# EAGLE design ArduiLED (EAGLE 6.4)
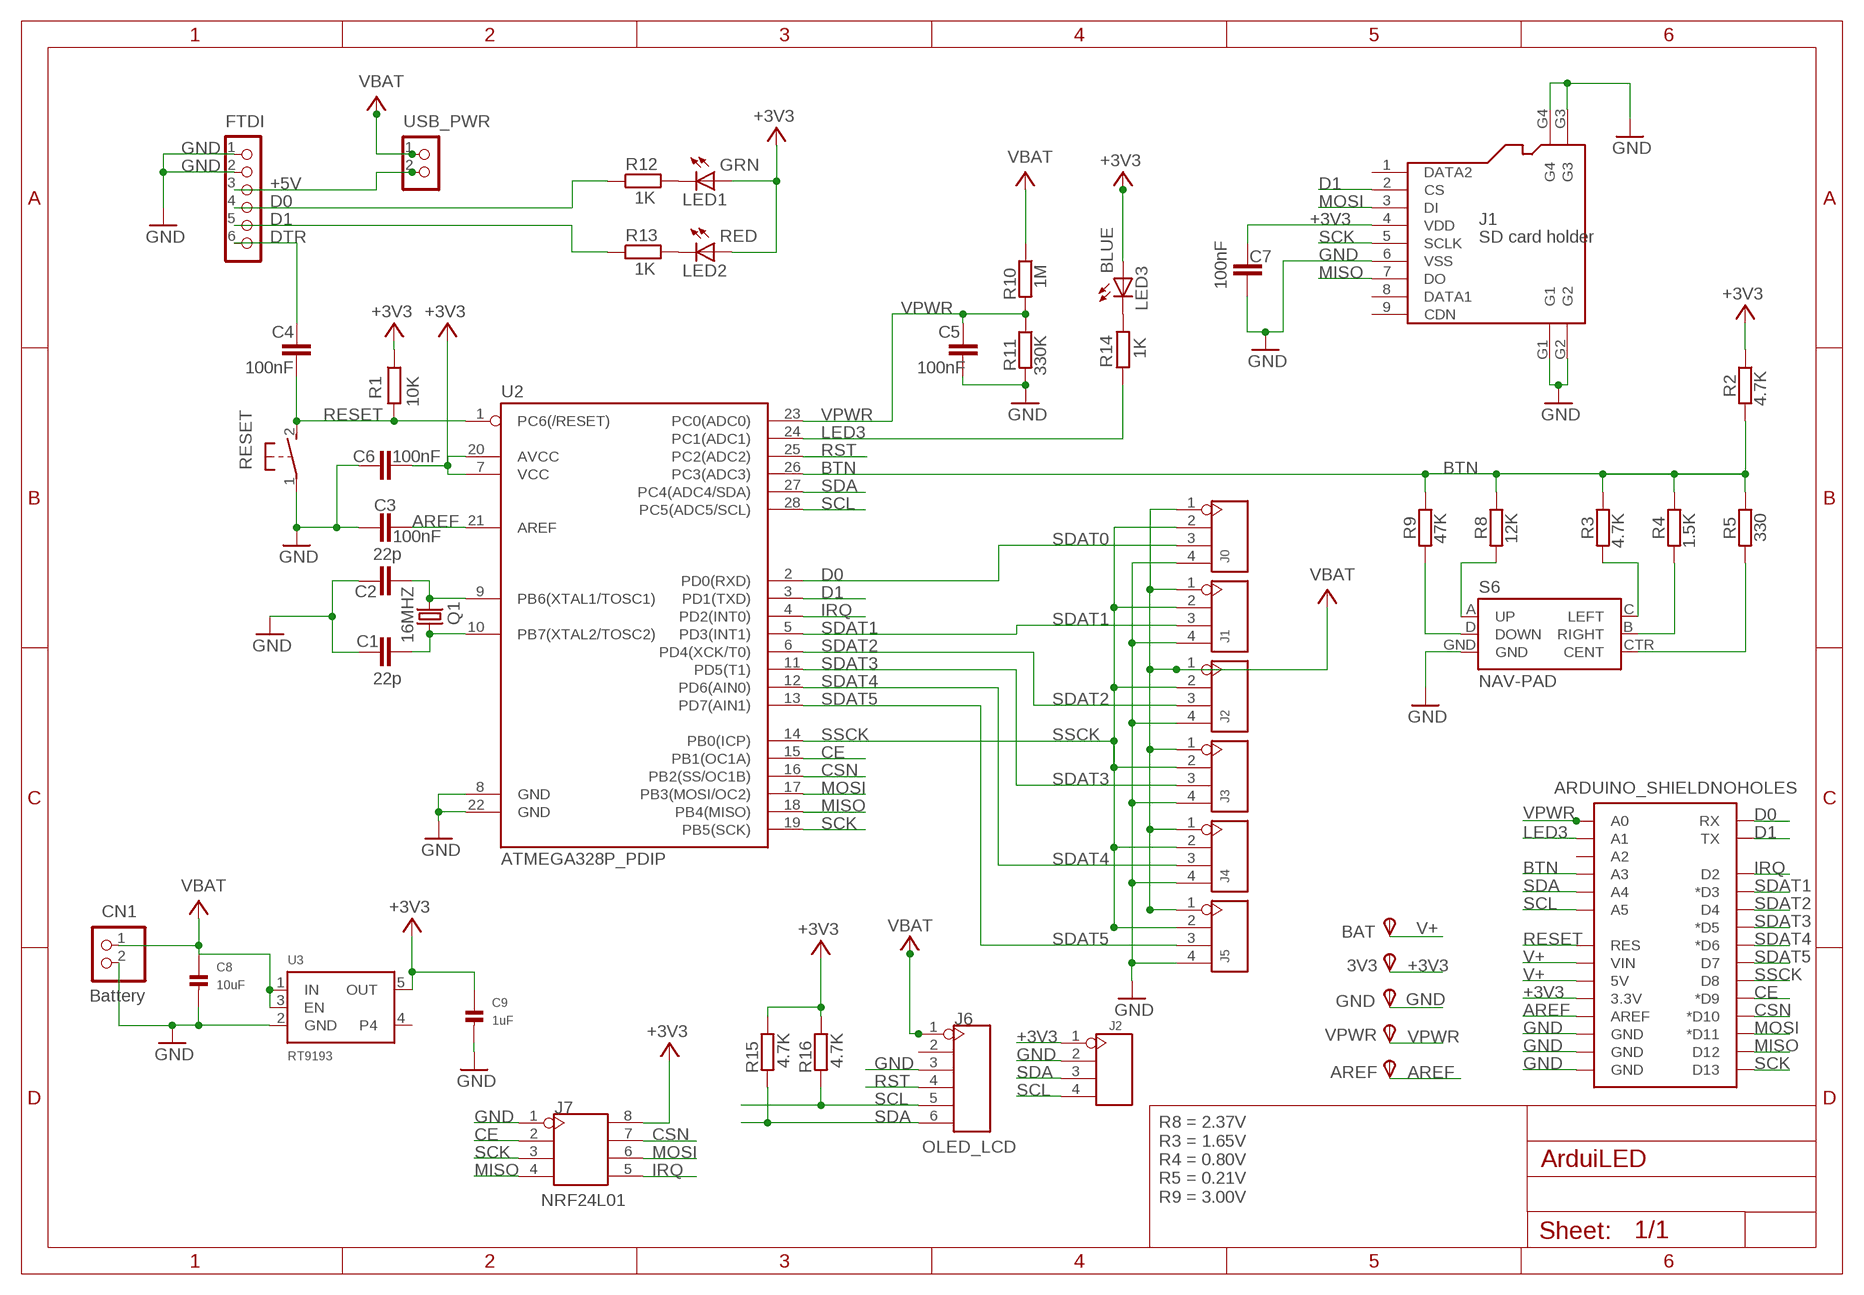
[diagram p0: schematic, sheet 1]

## Parts
3V3  TPSPAD1-13  [P1-13]
AREF  TPSPAD1-13  [P1-13]
BAT  TPSPAD1-13  [P1-13]
BRA  J2  HEADER-4P-80/40MIL  [4P-2.54-80/40MIL]
BRAS  J3  HEADER-4P-80/40MIL  [4P-2.54-80/40MIL]
C1  22p  C-EUC0805K  [C0805K]
C2  22p  C-EUC0805K  [C0805K]
C3  100nF  C-EUC0805K  [C0805K]
C4  100nF  C-EUC0805  [C0805]
C5  100nF  C-EUC0805K  [C0805K]
C6  100nF  C-EUC0805K  [C0805K]
C7  100nF  C-EUC0805K  [C0805K]
C8  10uF  CAP_CERAMIC0805  [0805]
C9  1uF  CAP_CERAMIC0805  [0805]
CN1  Battery  JST_2PIN-SMT-RA  [JST-PH-2-SMT-RA]
D7  J5  HEADER-4P-80/40MIL  [4P-2.54-80/40MIL]
FTDI  CON_HEADER_1X06-PTH-RIGHT-ANGLED  [M1X6_MALE_RIGHT_ANGLED]
GND  TPSPAD1-13  [P1-13]
J1  SD card holder  HOLDER-MICROSD-9P  [9P-SMD-W/-RING]
J2  HEADER-4P-65/35MIL  [4P-65/35MIL]
J6  OLED_LCD  HEADER-6P-65/35MIL  [6P-2.54-65/35MIL]
J7  NRF24L01  HEADER-2X4P-2.54  [2X4P-2.54]
JAMB  J4  HEADER-4P-80/40MIL  [4P-2.54-80/40MIL]
LED1  GRN  LED-0805  [LED-805]
LED2  RED  LED-0805  [LED-805]
LED3  BLUE  LED-0805  [LED-805]
Q1  16MHZ  CRYSTALHC49U-V  [HC49U-V]
R1  10K  R-EU_M0805  [M0805]
R2  4.7K  R-EU_M0805  [M0805]
R3  4.7K  R-EU_M0805  [M0805]
R4  1.5K  R-EU_M0805  [M0805]
R5  330  R-EU_M0805  [M0805]
R8  12K  R-EU_M0805  [M0805]
R9  47K  R-EU_M0805  [M0805]
R10  1M  R-EU_M0805  [M0805]
R11  330K  R-EU_M0805  [M0805]
R12  1K  R-EU_M0805  [M0805]
R13  1K  R-EU_M0805  [M0805]
R14  1K  R-EU_M0805  [M0805]
R15  4.7K  R-EU_M0805  [M0805]
R16  4.7K  R-EU_M0805  [M0805]
RESET  DTSM-3  [DTSM-3]
S6  NAV-PAD  JOYSTICK_MINI  [JOYSTICK_MINI]
TETE  J0  HEADER-4P-80/40MIL  [4P-2.54-80/40MIL]
TRONC  J1  HEADER-4P-80/40MIL  [4P-2.54-80/40MIL]
U1  ARDUINO_SHIELDNOHOLES  [DUEMILANOVE_SHIELD_NOHOLES]
U2  ATMEGA328P_PDIP  [DIL28-3]
U3  RT9193  VREG_SOT23-5  [SOT23-5]
USB_PWR  CON_HEADER_1X02-PTH  [M1X2]
VPWR  TPSPAD1-13  [P1-13]

## Nets
+3V3 [Power]: 3V3.TP(PP) C6.2 C7.1 C9.1 J1.4(VDD) J2.1 J7.8 LED1.A LED2.A LED3.A R1.1 R2.1 R15.1 R16.1 U1.3.3V U2.7(VCC) U2.20(AVCC) U3.5(OUT)
+5V [Power]: FTDI.3 USB_PWR.2
AREF: AREF.TP(PP) C3.1 U1.AREF U2.21(AREF)
BTN: R2.2 R3.1 R4.1 R5.1 R8.1 R9.1 U1.A3 U2.26(PC3(ADC3))
CE: J7.2 U1.D9(*D9) U2.15(PB1(OC1A))
CSN: J7.7 U1.D10(*D10) U2.16(PB2(SS/OC1B))
D0: FTDI.4 R12.1 TETE.3 U1.RX U2.2(PD0(RXD))
D1: FTDI.5 J1.2(CS) R13.1 U1.TX U2.3(PD1(TXD))
DTR: C4.1 FTDI.6
GND [Power]: BRA.4 BRAS.4 C1.1 C2.1 C3.2 C5.2 C6.1 C7.2 C8.2 C9.2 CN1.2 D7.4 FTDI.1 FTDI.2 GND.TP(PP) J1.6(VSS) J1.G1 J1.G2 J1.G3 J1.G4 J2.2 J6.3 J7.1 JAMB.4 R11.2 RESET.1 S6.GND TETE.4 TRONC.4 U1.GND@0(GND) U1.GND@1(GND) U1.GND@2(GND) U2.8(GND) U2.22(GND) U3.2(GND)
IRQ: J7.5 U1.D2 U2.4(PD2(INT0))
LED3: R14.1 U1.A1 U2.24(PC1(ADC1))
MISO: J1.7(DO) J7.4 U1.D12 U2.18(PB4(MISO))
MOSI: J1.3(DI) J7.6 U1.D11(*D11) U2.17(PB3(MOSI/OC2))
N$1: C2.2 Q1.2 U2.9(PB6(XTAL1/TOSC1))
N$2: C1.2 Q1.1 U2.10(PB7(XTAL2/TOSC2))
N$3: R8.2 S6.A(UP)
N$4: LED1.C R12.2
N$6: R3.2 S6.C(LEFT)
N$7: LED2.C R13.2
N$8: LED3.C R14.2
N$9: R4.2 S6.B(RIGHT)
N$10: R5.2 S6.CTR(CENT)
N$12: R9.2 S6.D(DOWN)
RESET: C4.2 R1.2 RESET.2 U1.RES U2.1(PC6(/RESET))
RST: J6.4 U2.25(PC2(ADC2))
SCK: J1.5(SCLK) J7.3 U1.D13 U2.19(PB5(SCK))
SCL: J2.4 J6.5 R16.2 U1.A5 U2.28(PC5(ADC5/SCL))
SDA: J2.3 J6.6 R15.2 U1.A4 U2.27(PC4(ADC4/SDA))
SDAT1: TRONC.3 U1.D3(*D3) U2.5(PD3(INT1))
SDAT2: BRA.3 U1.D4 U2.6(PD4(XCK/T0))
SDAT3: BRAS.3 U1.D5(*D5) U2.11(PD5(T1))
SDAT4: JAMB.3 U1.D6(*D6) U2.12(PD6(AIN0))
SDAT5: D7.3 U1.D7 U2.13(PD7(AIN1))
SSCK: BRA.2 BRAS.2 D7.2 JAMB.2 TETE.2 TRONC.2 U1.D8 U2.14(PB0(ICP))
V+ [Power]: BAT.TP(PP) BRA.1 BRAS.1 C8.1 CN1.1 D7.1 J6.1 JAMB.1 R10.1 TETE.1 TRONC.1 U1.5V U1.VIN U3.1(IN) U3.3(EN) USB_PWR.1 ; supply symbol labelled VBAT
VPWR: C5.1 R10.2 R11.1 U1.A0 U2.23(PC0(ADC0)) VPWR.TP(PP)
Unconnected: J1.1(DATA2) J1.8(DATA1) J1.9(CDN) J6.2 U1.A2 U3.4

## Notes on the sheet
- SDAT0
- R8 = 2.37V
  R3 = 1.65V
  R4 = 0.80V
  R5 = 0.21V
  R9 = 3.00V

## Library data of the parts
3V3 AREF BAT GND VPWR = testpad:TPS: TEST PIN
BRA BRAS D7 J2 JAMB TETE TRONC = Seeed-Connector:HEADER-4P
C1-C7 = resistor:C-EU: CAPACITOR, European symbol
C8 C9 = microbuilder:CAP_CERAMIC: Ceramic Capacitors 0402 - 0402 Surface Mount Capacitors 16pF 50V 5% [Digikey: 445-4899-2-ND] 18pF 50V 5% [Digikey: 490-1281-2-ND] 22pF 50V 5% [Digikey: 490-1283-2-ND] 68pF 50V 5% [Digikey: 490-1289-2-ND] 0.1uF 10V 10% [Digikey: 490-1318-2-ND] 1.0uF 6.3V 10% [Digikey: 490-1320-2-ND] 0603 - 0603 Surface Mount Capacitors 16 pF 50V 5% [Digikey: 445-5051-2-ND] 22 pF 50V [Digikey: PCC220ACVTR-ND] 33 pF 50V 5% [Digikey: 490-1415-1-ND] 56pF 50V 5% [Digikey: 490-1421-1-ND] 220pF 50V 5% [Digikey: 445-1285-1-ND] 680 pF 50V 2200 pF 50V 5% C0G [Digikey: 445-1297-1-ND] 5600 pF 100V 5% X7R [Digikey: 478-3711-1-ND] 0.1 µF 25V 10% [Digikey: PCC2277TR-ND] 0.22 µF 16V 10% X7R [Digikey: 445-1318-1-ND] 1.0 µF 25V 10% [Digikey: 445-5146-2-ND] 0603 - RF Specific 3pF 250V +/-0.1pF RF [Digikey: 712-1347-1-ND] 18 pF 250V 5% [Digikey: 478-3505-1-ND or 712-1322-1-ND] 56 pF 250V 5% C0G RF [Digikey: 490-4867-1-ND] 68 pF 250V RF [Digikey: 490-4868-1-ND] 0805 - 0805 Surface Mount Capacitors 220 pF 250V 2% RF Ceramic Capacitor [Digikey: 712-1398-1-ND] 1000 pF 50V 2% NP0 Ceramic Capacitor [Digikey: 478-3760-1-ND] 0.1 µF 25V 10% Ceramic Capacitor [Digikey: PCC1828TR-ND] 1.0 µF 16V 10% Ceramic Capacitor[Digikey: 490-1691-2-ND] 10.0 µF 10V 10% Ceramic Capacitor[Digikey: 709-1228-1-ND] 10.0 uF 16V 10% Ceramic Capacitor [Digikey: 478-5165-2-ND] 47 uF 6.3V 20% Ceramic Capacitor [Digikey: 587-1779-1-ND or 399-5506-1-ND] 1206 - 1206 Surface Mount Capacitors 47uF 10V 20% Ceramic Capacitor [Digikey: 490-5528-1-ND or 399-5508-1-ND or 445-6010-1-ND] 100uF 6.3V -20%, +80% Y5V Ceramic Capacitor (Digikey: 490-4512-1-ND, Mouser: 81-GRM31CF50J107ZE1L)
CN1 = adafruit:JST_2PIN: JST 2-Pin Connectors of various flavors SMT-RA (S2B-PH-SM4) 4UConnector #17311 SMT (B2B-PH-SM4) THM-RA (S2B-PH) THM (B2B-PH)
FTDI = dp_devices:CON_HEADER_1X06
J1 = Connector:HOLDER-MICROSD-9P
J6 = Seeed-Connector:HEADER-6P
J7 = Seeed-Connector:HEADER-2X4P
LED1-LED3 = dp_devices:LED: Light Emitting Diode
Q1 = crystal:CRYSTAL: CRYSTAL; OC_FARNELL: 1666969; OC_NEWARK: unknown
R1-R5 R8-R16 = resistor:R-EU_: RESISTOR, European symbol
RESET = switch-tact:DTSM-3
S6 = SparkFun-Electromechanical:JOYSTICK_MINI: Small 5-way tactile joystick, COM-10063 4UCON SF303GJ26
U1 = SparkFun-Boards:ARDUINO_SHIELD: Arduino shield footprint
U2 = SparkFun-DigitalIC:ATMEGA328P_PDIP: uC used in the Arduino 32kb flash, 1k EEPROM, 2k SRAM This is the through-hole version of this chip.
U3 = microbuilder:VREG_SOT23-5: SOT23-5 Fixed Voltage Regulators To better organise some of the SOT23-5 fixed voltage regulators in this library, this new part was created. Part Current Out V Out V In V Dropout Digikey Part No. ADP121 150mA 3.3V 3.4-5.5V 0.09V @ 150mA ADP121-AUJZ33R7CT-ND ADP121 150mA 3.0V 3.1-5.5V 0.09V @ 150mA ADP121-AUJZ30R7CT-ND ADP122 300mA 3.3V 3.4-5.5V 0.085V @ 300mA ADP122AUJZ-3.3-R7CT-ND ADP1712 300mA 3.3V 3.5-5.5V 0.17V @ 300mA ADP1712AUJZ-3.3-R7TR-ND AP7311 (Low Cost) 150mA 3.3V 3.5-6V 0.15V @ 150mA AP7311-33WG-7DICT-ND LD39015M18R 150mA 1.8V 1.9V-5.5V 0.08V @ 100mA 497-6977-1-ND MCP1824T-3302E/OT 300mA 3.3V 3.5V-6V 0.2V @ 300mA MCP1824T-3302E/OTCT-ND MIC5205-2.5YM5 TR 150mA 2.5V 2.7-16V 0.165V @ 150mA 576-1257-2-ND MIC5205-3.0YM5 TR 150mA 3.0V 3.2V-16V 0.165V @ 150mA 576-1258-2-ND MIC5205-3.3YM5 TR 150mA 3.3V 3.5V-16V 0.165V @ 150mA 576-1259-2-ND TPS780330220 150mA 3.3V+2.2V 3.6-5.5V 250mV Max 296-23332-1-ND TDA3663/N1,135 100mA 3.3V 3.5-45V 0.18V @ 50mA 568-5343-1-ND
USB_PWR = dp_devices:CON_HEADER_1X02

## Net classes
1 Power: width 0.203 mm, drill 0.305 mm, clearance 0.152 mm
2 Big Power: width 0.203 mm, drill 0.305 mm, clearance 0.152 mm

## Board
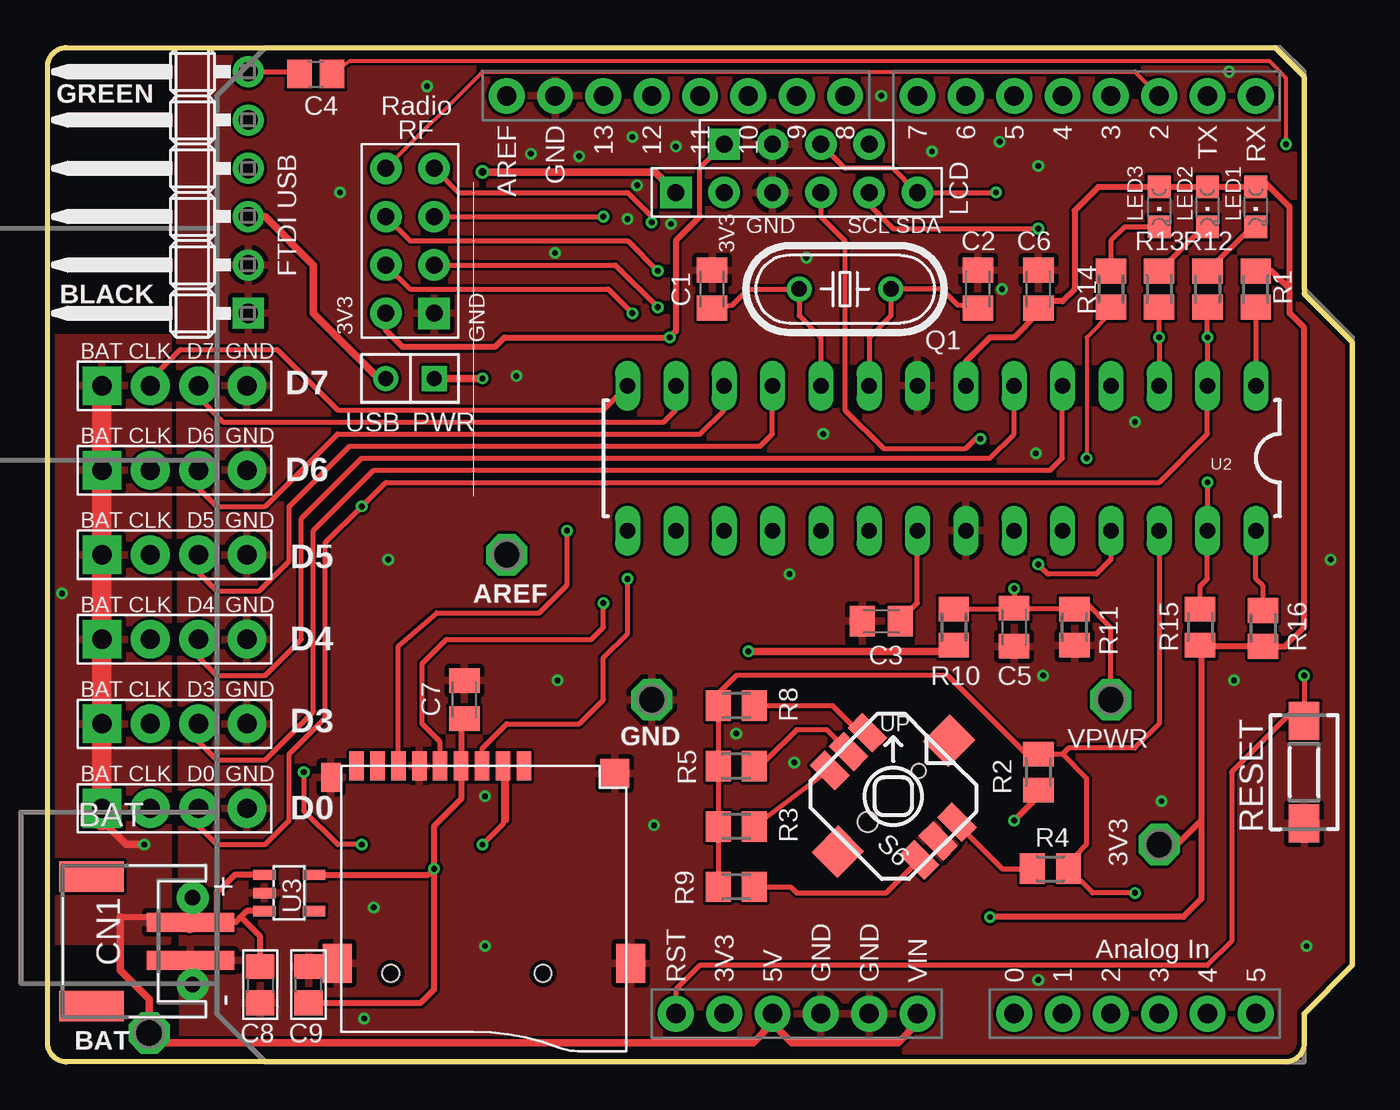
[diagram p1: board, top side]
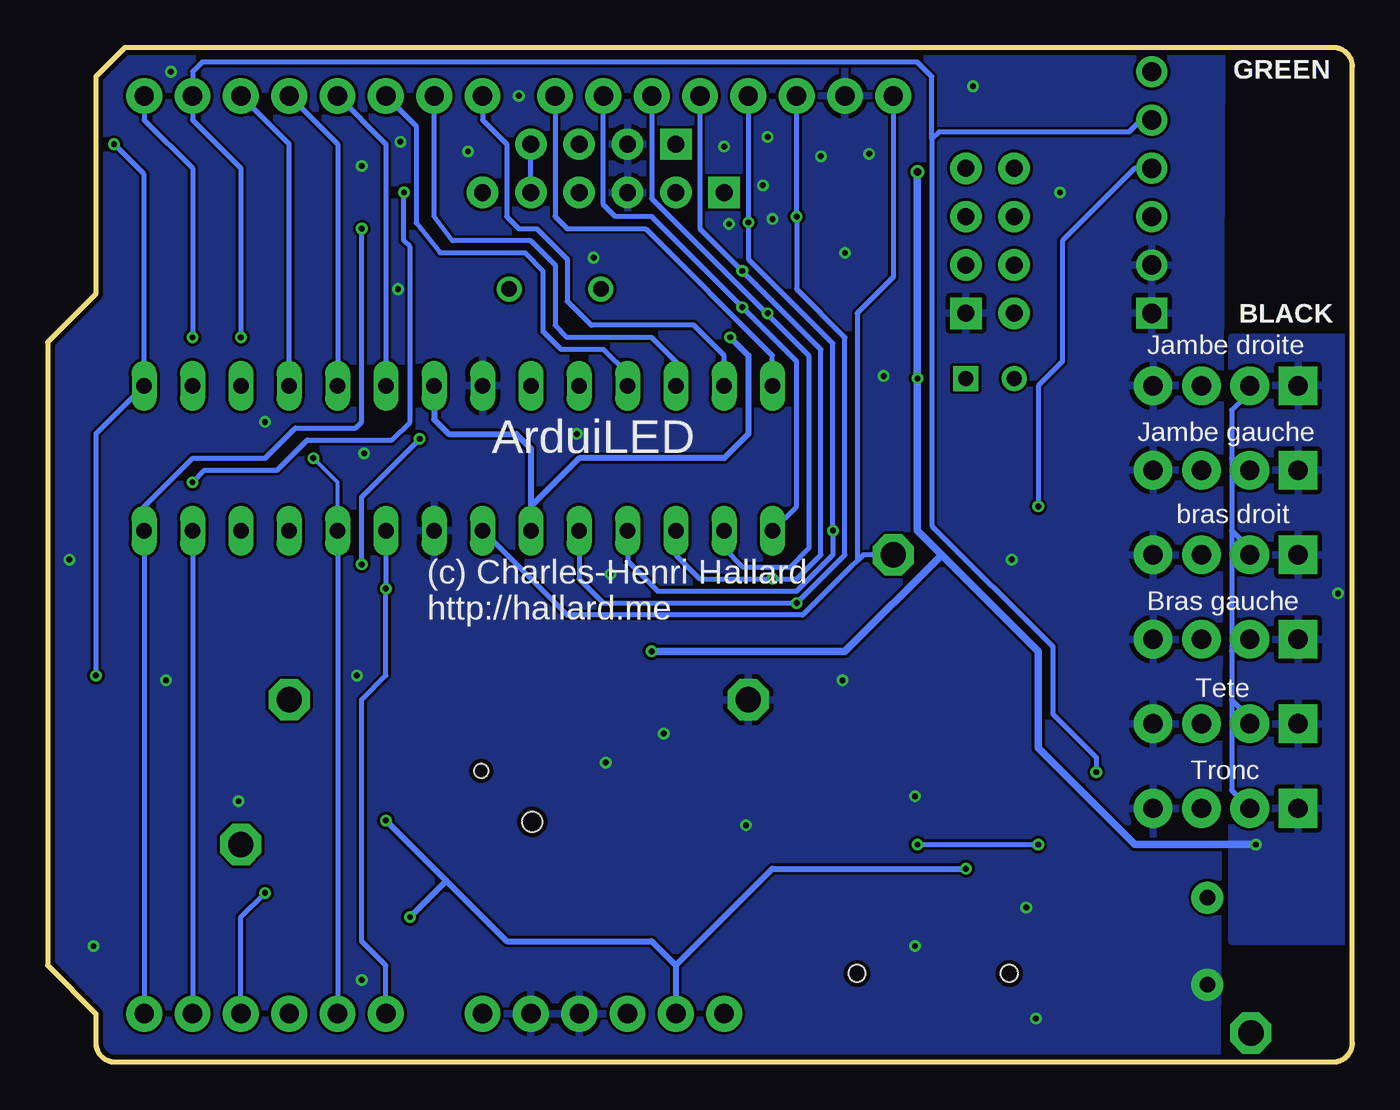
[diagram p2: board, bottom side, seen from below]

Size 68.58 x 53.34 mm. Coordinates in mm from the lower left corner, seen from the top.
Outline: 64.52,53.34 66.04,51.82 66.04,40.39 68.58,37.85 68.58,5.08 66.04,2.54 66.04,1 arc-90 65.04,0 1,0 arc-90 0,1 0,52.34 arc-90 1,53.34 64.52,53.34
Copper layers (1*16): Top 0.035mm / dielectric 1.5mm / Bottom 0.035mm
Design rules "SeedStudio_v1.1": minimum track width 6mil, minimum drill 12mil, track to track 6mil, track to pad 6mil, pad to pad 6mil, via to via 6mil, smd to smd 0mil, copper to edge 10mil, drill to drill 10mil, minimum pad ring 10mil, minimum via ring 6mil, stop-mask expansion 2mil, vias tented up to drill 100mil, thermal gap 10mil

### Footprints (pad centres in the part's own frame; a part is rotated, then mirrored left to right if it is on the bottom)
P1-13 = drill 1.321 pad 2.159 octagon: TP 0,0
4P-2.54-80/40MIL = drill 1.016 pad 2.032 square: 1 0,3.81 | drill 1.016 pad 2.032: 2 0,1.27; 3 0,-1.27; 4 0,-3.81
C0805K = smd 1.3 x 1.6: 1 -1,0; 2 1,0
C0805 = smd 1.3 x 1.5: 1 -0.85,0; 2 0.85,0
0805 = smd 1.3 x 1.5: 1 -0.95,0; 2 0.95,0
JST-PH-2-SMT-RA = smd 1 x 4.6: 1 1,-3.7; 2 -1,-3.7 | smd 1.6 x 3.4: NC1 -3.4,1.5; NC2 3.4,1.5
M1X6_MALE_RIGHT_ANGLED = drill 1.02 pad 1.632 square: 1 -6.35,-2.925 | drill 1.02 pad 1.632: 2 -3.81,-2.925; 3 -1.27,-2.925; 4 1.27,-2.925; 5 3.81,-2.925; 6 6.35,-2.925
9P-SMD-W/-RING = smd 1.524 x 0.762: 1 0,4.4; 2 0,3.3; 3 0,2.2; 4 0,1.1; 5 0,0; 6 0,-1.1; 7 0,-2.2; 8 0,-3.3; 9 0,-4.4 | smd 1.524 x 1.016: G1 0.6,-5.746 | smd 2.032 x 1.524: G2 10.373,-5.4; G3 10.373,10 | smd 1.524 x 1.524: G4 0.392,9.181 | hole 0.889: 10.9,-2.6; 10.9,5.4
4P-65/35MIL = drill 0.889 pad 1.651 square: 1 0,3.81 | drill 0.889 pad 1.651: 2 0,1.27; 3 0,-1.27; 4 0,-3.81
6P-2.54-65/35MIL = drill 0.889 pad 1.651 square: 1 0,6.35 | drill 0.889 pad 1.651: 2 0,3.81; 3 0,1.27; 4 0,-1.27; 5 0,-3.81; 6 0,-6.35
2X4P-2.54 = drill 0.889 pad 1.651 square: 1 -1.27,3.81 | drill 0.889 pad 1.651: 2 -1.27,1.27; 3 -1.27,-1.27; 4 -1.27,-3.81; 5 1.27,-3.81; 6 1.27,-1.27; 7 1.27,1.27; 8 1.27,3.81
LED-805 = smd 1.2 x 1.2: A 0,-1.05; C 0,1.05
HC49U-V = drill 0.813: 1 -2.413,0; 2 2.413,0
M0805 = smd 1.3 x 1.6: 1 -0.95,0; 2 0.95,0
DTSM-3 = smd 2 x 1.6: 1 -2.7,0; 2 2.7,0
JOYSTICK_MINI = smd 1.85 x 1.1: A -3.325,1.4; B 3.325,1.4; C -3.325,-1.4; CTR -3.325,0; D 3.325,-1.4; GND 3.325,0 | smd 1.9 x 2: NC 0,4.13; NC@0 0,-4.13 | hole 0.75: 0,1.9 | hole 1.05: 0,-1.9
DUEMILANOVE_SHIELD_NOHOLES = drill 1.016 pad 1.88: 3.3V 50.8,26.67; 5V 50.8,29.21; A0 50.8,41.91; A1 50.8,44.45; A2 50.8,46.99; A3 50.8,49.53; A4 50.8,52.07; A5 50.8,54.61; AREF 2.54,15.24; D2 2.54,49.53; D3 2.54,46.99; D4 2.54,44.45; D5 2.54,41.91; D6 2.54,39.37; D7 2.54,36.83; D8 2.54,33.02; D9 2.54,30.48; D10 2.54,27.94; D11 2.54,25.4; D12 2.54,22.86; D13 2.54,20.32; GND@0 50.8,31.75; GND@1 50.8,34.29; GND@2 2.54,17.78; RES 50.8,24.13; RX 2.54,54.61; TX 2.54,52.07; VIN 50.8,36.83
DIL28-3 = drill 0.813 long: 1 -16.51,-3.81; 2 -13.97,-3.81; 3 -11.43,-3.81; 4 -8.89,-3.81; 5 -6.35,-3.81; 6 -3.81,-3.81; 7 -1.27,-3.81; 8 1.27,-3.81; 9 3.81,-3.81; 10 6.35,-3.81; 11 8.89,-3.81; 12 11.43,-3.81; 13 13.97,-3.81; 14 16.51,-3.81; 15 16.51,3.81; 16 13.97,3.81; 17 11.43,3.81; 18 8.89,3.81; 19 6.35,3.81; 20 3.81,3.81; 21 1.27,3.81; 22 -1.27,3.81; 23 -3.81,3.81; 24 -6.35,3.81; 25 -8.89,3.81; 26 -11.43,3.81; 27 -13.97,3.81; 28 -16.51,3.81
SOT23-5 = smd 0.55 x 1.2: 1 -0.95,-1.3; 2 0,-1.3; 3 0.95,-1.3; 4 0.95,1.3; 5 -0.95,1.3
M1X2 = drill 0.8 square: 1 -1.27,0 | drill 0.8: 2 1.27,0

### Placement (x,y rotation side)
3V3  58.42,11.43 0 top
AREF  24.13,26.67 0 top
BAT  5.33,1.52 0 top
BRA  6.67,22.23 90 top
BRAS  6.67,26.67 90 top
C1  34.92,40.64 270 top
C2  48.9,40.64 270 top
C3  43.81,23.18 180 top
C4  14.1,51.94 0 top
C5  50.8,22.86 270 top
C6  52.07,40.64 270 top
C7  21.91,19.05 90 top
C8  11.18,4.06 270 top
C9  13.72,4.06 90 top
CN1  3.81,6.35 90 top
D7  6.67,35.56 90 top
FTDI  7.62,45.72 90 top
GND  31.75,19.05 0 top
J1  20.64,15.56 270 top
J2  39.37,48.26 90 top
J6  39.37,45.72 90 top
J7  19.05,43.18 180 top
JAMB  6.67,31.11 90 top
LED1  63.5,44.96 180 top
LED2  60.96,44.96 180 top
LED3  58.42,44.96 180 top
Q1  41.91,40.64 0 top
R1  63.5,40.64 270 top
R2  52.07,15.24 90 top
R3  36.2,12.38 0 top
R4  52.7,10.16 180 top
R5  36.2,15.56 0 top
R8  36.2,18.73 0 top
R9  36.2,9.21 0 top
R10  47.62,22.86 90 top
R11  53.98,22.86 270 top
R12  60.96,40.64 90 top
R13  58.42,40.64 90 top
R14  55.88,40.64 90 top
R15  60.58,22.86 90 top
R16  63.88,22.8 90 top
RESET  66.04,15.24 90 top
S6  44.45,13.97 315 top
TETE  6.67,13.34 90 top
TRONC  6.67,17.78 90 top
U1  8.89,53.34 270 top
U2  46.99,31.75 180 top
U3  12.7,8.89 270 top
USB_PWR  19.05,35.94 180 top
VPWR  55.88,19.05 0 top

### Tracks (layer width: path | path; a pad name or v marks a point on that pad's centre or on a via)
+3V3  (via drill 0.3, 0.3 pad 0.41)
  Top 0.254: 52.07,39.37 C6.2 52.28,40.01 | 48.26,36.83 U2.7 | 21.74,18.03 C7.1 | R2.1 52.07,13.97 | J2.1 34.29,46.99 34.29,44.45
  Top 0.305: 52.07,39.37 50.8,38.1 49.53,38.1 48.26,36.83 | 52.28,40.01 53.34,40.01 53.98,40.64 53.98,44.77 55.22,46.01 LED3.A LED2.A LED1.A 63.72,46.23 64.01,46.23 65.28,44.96 65.28,40.64 | 52.07,13.97 v50.8,12.7 | 21.74,18.03 J1.4 21.74,13.82 20.32,12.4 v20.32,10.16 | 65.28,40.64 65.28,39.37 66.04,38.61 66.04,22.86 65.03,21.85 R16.1 60.64,21.85 | R1.1 64.33,41.59 65.28,40.64 | 60.64,21.85 60.64,12.7 | 60.64,12.7 60.64,8.57 59.69,7.62 v49.53,7.62 | 60.64,21.85 R15.1 | J7.8 17.78,38.48 18.67,37.59 23.5,37.59 24,38.1 v32.7,38.1 33.02,38.42 33.02,43.18 34.29,44.45 | 3V3.TP 59.37,11.43 60.64,12.7 | 13.78,3.05 C9.1 19.62,3.11 20.32,3.81 v20.32,10.16 | U3.5 20,9.84 v20.32,10.16
  Bottom 0.305: 43.18,29.21 U2.20 | v50.8,12.7 47.62,9.53 | 47.62,9.53 44.45,6.35 36.83,6.35 35.56,5.08 | 35.56,5.08 U1.3.3V | v32.7,38.1 31.75,37.15 31.75,33.02 33.02,31.75 40.64,31.75 43.18,29.21 | U2.7 48.26,33.78 47.5,33.02 43.94,33.02 43.18,32.26 43.18,29.21 | v49.53,7.62 47.62,9.53 | 35.56,5.08 30.48,10.16 v20.32,10.16
+5V
  Top 0.406: FTDI.3 11.43,44.45 13.97,41.91 13.97,39.37 17.4,35.94 USB_PWR.2
AREF
  Top 0.254: C3.1 44.77,23.18 45.72,24.13 U2.21
  Bottom 0.254: U1.AREF 24.13,41.27 26.04,39.37 26.04,26.35 | 26.04,26.35 26.32,26.07 28.89,23.5 41.27,23.5 U2.21 | AREF.TP 25.72,26.67 26.04,26.35
BTN  (via drill 0.3 pad 0.41)
  Top 0.254: R4.1 54.92,8.89 v57.15,8.89 | R9.1 R3.1 R5.1 R8.1 35.24,19.37 36.2,20.32 47.31,20.32 51.44,16.19 R2.2 53.34,16.19 | R4.1 | R4.1 53.98,10.48 53.98,10.79 54.61,11.43 54.61,14.92 53.34,16.19 | U2.26 58.42,17.78 57.15,16.51 53.66,16.51 53.34,16.19
  Bottom 0.254: U1.A3 58.42,7.62 v57.15,8.89
CE  (via drill 0.3 pad 0.38)
  Top 0.254: J7.2 29.84,41.91 v32.07,39.69
  Bottom 0.254: U2.15 29.21,29.21 29.21,36.83 v32.07,39.69 36.83,44.45 38.73,44.45 39.37,45.09 U1.D9
CSN  (via drill 0.3 pad 0.38)
  Top 0.254: J7.7 19.05,40.64 29.46,40.64 v30.73,39.37
  Bottom 0.254: U2.16 33.02,26.99 32.07,26.04 29.53,26.04 28.57,26.99 28.57,37.15 30.64,39.21 30.73,39.31 | U1.D10 36.83,45.4 30.73,39.31 | v30.73,39.37 30.73,39.31
D0  (via drill 0.3 pad 0.38, 0.3 pad 0.41)
  Top 0.254: TETE.3 7.94,12.38 8.89,11.43 11.43,11.43 12.7,12.7 12.7,16.19 14.61,18.1 14.61,27.3 v16.51,29.21 17.78,30.48 58.42,30.48 60.96,33.02 U2.2 v60.96,38.1 R12.1
  Bottom 0.254: U1.RX 63.5,49.53 60.96,46.99 v60.96,38.1 | FTDI.4 11.43,46.99 15.24,43.18 15.24,36.83 16.51,35.56 v16.51,29.21
D1  (via drill 0.3, 0.3 pad 0.38)
  Top 0.254: U2.3 v58.42,38.1 R13.1 | v13.46,15.24 13.46,13.21 15.24,11.43 v16.51,11.43 | 24.13,12.7 24.13,15.37 J1.2 23.94,12.51 v22.86,11.43
  Bottom 0.254: v58.42,38.1 58.42,46.99 60.96,49.53 U1.TX 60.96,52.07 60.45,52.58 22.86,52.58 22.1,51.82 22.1,48.51 | FTDI.5 11.11,49.53 11.75,48.9 21.72,48.9 22.1,48.51 | 22.1,48.51 22.1,28.19 15.75,21.84 15.75,18.29 13.46,16 v13.46,15.24 | v22.86,11.43 v16.51,11.43
DTR
  Top 0.254: FTDI.6 13.12,52.07 C4.1
GND  (via drill 0.3 pad 0.41, 0.81 pad 1.68)
  other vias: 26.8,20.07 58.55,13.72 62.36,20.07 38.99,25.65 39.24,15.75 36.2,17.27 19.94,51.31 16.64,2.29 22.99,6.1 17.14,8.13 17.91,26.42 31.88,12.45 40.77,33.02 15.37,45.72 22.99,13.97 51.94,32 67.44,26.42 66.17,6.1 25.4,47.75 26.67,42.55 46.48,47.88 24.64,36.07 39.88,42.29 30.48,44.32 32.77,44.07 30.73,48.64 50.16,40.64 57.15,33.66 52.32,20.32 52.07,4.32 27.94,47.62 33.02,48.13 43.81,50.8 62.1,52.07 52.07,47.12 50.04,48.39 30.99,46.1 7.62,4.06
  pour Bottom: 6.86,53.34 68.58,53.34 68.58,0 7.11,0
  pour Top: 6.86,53.34 68.58,53.34 68.58,0 7.11,0
IRQ
  Top 0.203: J7.5 22.86,52.07 57.15,52.07 U1.D2
  Bottom 0.254: U1.D2 55.88,48.26 U2.4
LED3  (via drill 0.3 pad 0.38)
  Top 0.203: R14.1 55.88,39.37 54.61,38.1 v54.61,31.75
  Bottom 0.203: U2.24 53.34,30.48 v54.61,31.75
  Bottom 0.254: U2.24 U1.A1
MISO  (via drill 0.3 pad 0.38)
  Top 0.254: J7.4 21.59,45.72 30.48,45.72 31.75,44.45 v31.75,44.15 | J1.7 18.44,21.87 20.45,23.62 25.84,23.62 27.3,25.08 v27.3,27.94
  Bottom 0.254: U2.18 38.1,26.35 36.51,24.77 29.21,24.77 27.3,26.67 v27.3,27.94 27.3,37.78 31.75,42.23 v31.75,44.15 U1.D12
MOSI  (via drill 0.3 pad 0.38)
  Top 0.254: J7.6 19.05,43.18 30.48,43.18 v32.07,41.59 | J1.3 22.84,16.49 24.13,17.78 27.94,17.78 29.21,19.05 29.21,21.27 30.48,22.54 v30.48,25.4
  Bottom 0.254: U2.17 35.56,26.67 34.29,25.4 v30.48,25.4 29.21,25.4 27.94,26.67 27.94,37.47 v32.07,41.59 34.29,43.81 U1.D11
N$1
  Top 0.254: U2.9 43.18,38.1 44.32,39.24 Q1.2 46.99,40.64 47.84,39.79 C2.2
N$2
  Top 0.254: U2.10 40.64,38.1 39.5,39.24 Q1.1 36.83,40.64 35.98,39.79 C1.2
N$3
  Top 0.254: S6.A 42.7,17.31 41.27,18.73 R8.2
N$4
  Top 0.254: LED1.C 63.28,43.91 R12.2
N$6
  Top 0.254: S6.C 41.05,15.33 R3.2
N$7
  Top 0.254: LED2.C 60.74,43.91 R13.2
N$8
  Top 0.254: LED3.C 56.61,43.91 55.88,43.18 R14.2
N$9
  Top 0.254: S6.B 47.79,12.53 50.16,10.16 R4.2
N$10
  Top 0.254: S6.CTR 40.96,17.46 39.37,17.46 37.78,15.88 R5.2
N$12
  Top 0.254: R9.2 39.05,9.21 39.37,8.89 44.07,8.89 S6.D
RESET  (via drill 0.3, 0.3 pad 0.41)
  Top 0.203: v65.09,48.26 65.09,51.75 64.2,52.64 15.9,52.64 C4.2
  Top 0.254: U1.RES 33.02,3.81 34.29,5.08 60.96,5.08 62.23,6.35 62.23,15.24 65.48,18.49 RESET.2 v66.04,20.32 | R1.2 U2.1
  Bottom 0.254: v65.09,48.26 63.5,46.67 U2.1 66.04,33.02 v66.04,20.32
RST  (via drill 0.3)
  Top 0.254: J6.4 40.64,44.45 41.91,43.18 41.91,34.29 43.94,32.26 48.26,32.26 48.77,32.77 v49.02,32.77 | U2.25 55.88,26.42 55.12,25.65 52.58,25.65 v52.07,26.16
  Bottom 0.254: v52.07,26.16 52.07,29.72 v49.02,32.77
SCK  (via drill 0.3 pad 0.38)
  Top 0.254: J7.3 v29.21,44.45 | J1.5 20.64,16.83 19.68,17.78 19.68,20.95 20.95,22.23 28.57,22.23 29.21,22.86 v29.21,24.13
  Bottom 0.254: U2.19 40.64,25.4 39.37,24.13 v29.21,24.13 26.67,26.67 26.67,38.1 29.21,40.64 v29.21,44.45 U1.D13
SCL  (via drill 0.3 pad 0.41)
  Top 0.254: J6.5 43.18,45.09 44.45,43.81 v52.07,43.81 | R16.2 63.88,25.02 63.5,25.4 U2.28
  Bottom 0.254: U1.A5 U2.28 63.5,29.21 60.96,31.75 57.15,31.75 55.56,33.34 52.39,33.34 52.07,33.66 v52.07,43.81 | J6.5 J2.4
SDA  (via drill 0.3 pad 0.41)
  Top 0.254: v60.96,30.48 U2.27 60.96,25.4 60.58,25.02 R15.2 | v49.85,45.72 J6.6 44.45,46.99 41.91,46.99 J2.3
  Bottom 0.254: U2.27 U1.A4 | v60.96,30.48 60.33,31.11 56.52,31.11 54.93,32.7 50.48,32.7 49.53,33.66 49.53,42.86 49.85,43.18 v49.85,45.72
SDAT1
  Top 0.254: TRONC.3 7.94,16.83 8.89,15.88 11.43,15.88 13.97,18.41 13.97,27.94 17.14,31.11 52.7,31.11 53.34,31.75 U2.5
  Bottom 0.254: U2.5 53.34,48.26 U1.D3
SDAT2
  Top 0.254: BRA.3 7.94,21.27 8.89,20.32 11.43,20.32 13.34,22.23 13.34,28.57 16.51,31.75 49.53,31.75 50.8,33.02 U2.6
  Bottom 0.254: U2.6 50.8,48.26 U1.D4
SDAT3
  Top 0.254: BRAS.3 7.94,25.72 8.89,24.77 11.11,24.77 12.7,26.35 12.7,29.21 15.88,32.38 37.47,32.38 38.1,33.02 U2.11
  Bottom 0.254: U2.11 38.1,36.2 39.37,37.47 41.59,37.47 42.55,38.42 42.55,41.59 43.5,42.55 47.94,42.55 49.21,44.13 49.21,49.21 U1.D5
SDAT4
  Top 0.254: JAMB.3 7.94,30.16 8.89,29.21 11.43,29.21 15.24,33.02 34.29,33.02 35.56,34.29 U2.12
  Bottom 0.254: U2.12 35.56,36.83 36.83,38.1 41.27,38.1 41.91,38.73 41.91,41.91 43.18,43.18 47.31,43.18 48.26,44.45 U1.D6
SDAT5
  Top 0.254: D7.3 7.94,34.92 9.21,33.66 32.38,33.66 33.02,34.29 U2.13
  Bottom 0.254: U2.13 33.02,37.15 34.61,38.73 40.01,38.73 41.27,40.01 41.27,42.23 42.86,43.81 43.81,43.81 44.45,44.45 44.45,48.26 45.72,49.53 U1.D7
SSCK
  Top 0.254: D7.2 5.4,35.88 6.99,37.47 12.06,37.47 15.24,34.29 29.21,34.29 U2.14
  Bottom 0.254: U1.D8 41.91,44.45 41.27,43.81 37.15,43.81 30.48,37.15 U2.14 | D7.2 5.4,35.24 6.35,34.29 6.35,31.75 | 6.35,31.75 6.35,27.94 | 6.35,27.94 6.35,21.59 | 6.35,21.59 6.35,19.05 | 6.35,19.05 6.35,14.29 TETE.2 | JAMB.2 5.71,31.11 6.35,31.75 | BRAS.2 5.4,26.99 6.35,27.94 | BRA.2 5.71,22.23 6.35,21.59 | TRONC.2 5.4,18.1 6.35,19.05
V+  (via drill 0.3, 0.3 pad 0.41, 0.41 pad 0.41, 0.81 pad 1.68)
  Top 0.305: 3.81,7.62 7.62,7.62 v7.62,8.64 | 7.51,7.37 CN1.1 | U3.3 10.48,7.94 10.16,7.62 | 10.16,7.62 9.91,7.37 8.89,7.37 | 8.89,7.37 7.53,7.37 CN1.1 | R10.1 47.31,21.59 | C8.1 11.18,6.6 10.16,7.62 | 7.62,7.46 CN1.1 | U3.1 9.84,9.84 8.89,8.89 8.89,7.37
  Top 0.406: J6.1 31.94,46.8 v22.86,46.8 | v5.08,11.43 4.13,11.43 2.86,12.7 | 47.31,21.59 v36.83,21.59 | 38.1,2.03 37.08,1.02 5.84,1.02 BAT.TP 5.33,3.3 3.81,4.83 3.81,7.62 | U1.5V 38.1,2.03 | 38.1,2.03 39.12,1.02 44.7,1.02 45.72,2.03 U1.VIN | USB_PWR.1 v22.86,35.94
  Top 1.016: 2.86,12.7 TETE.1 TRONC.1 BRA.1 BRAS.1 JAMB.1 D7.1 | 7.46,7.3 CN1.1
  Bottom 0.406: v22.86,46.8 v22.86,35.94 22.86,27.94 21.59,26.67 | 21.59,26.67 16.51,21.59 16.51,16.51 11.43,11.43 v5.08,11.43 | v36.83,21.59 26.67,21.59 21.59,26.67
  other vias: 0.76,24.64
  pour Top: -1.27,38.1 6.35,38.1 6.35,6.35 -1.27,6.35
  pour Bottom: -1.27,38.1 -1.27,6.35 6.35,6.35 6.35,38.1
VPWR  (via drill 0.3 pad 0.41)
  Top 0.254: C5.1 50.9,23.81 R11.1 54.3,24.13 54.61,24.13 55.88,22.86 VPWR.TP | R10.2 50.7,23.81 C5.1 | v50.8,24.89 C5.1
  Bottom 0.254: U1.A0 50.8,5.08 52.07,6.35 52.07,19.05 50.8,20.32 v50.8,24.89 U2.23

### Text on the board
tNames: GREEN | Radio | RF | FTDI USB | LCD | 3V3 | GND | SCL | SDA | BLACK | 3V3 | GND | BAT | CLK | D7 | GND | D7 | USB | PWR | BAT | CLK | D6 | GND | D6 | BAT | CLK | D5 | GND | D5 | BAT | CLK | D4 | GND | D4 | BAT | CLK | D3 | GND | D3 | BAT | CLK | D0 | GND | D0 | BAT | RESET
bNames: GREEN | BLACK | Jambe droite | ArduiLED | Jambe gauche | bras droit | Bras gauche | (c) Charles-Henri Hallard / http://hallard.me | Tete | Tronc
Measures: VIN | GND | SCL | 3.3V | RST | SDA